# EAGLE schematic FIIDO_D2_MPU6050_display (EAGLE 8.3.1)
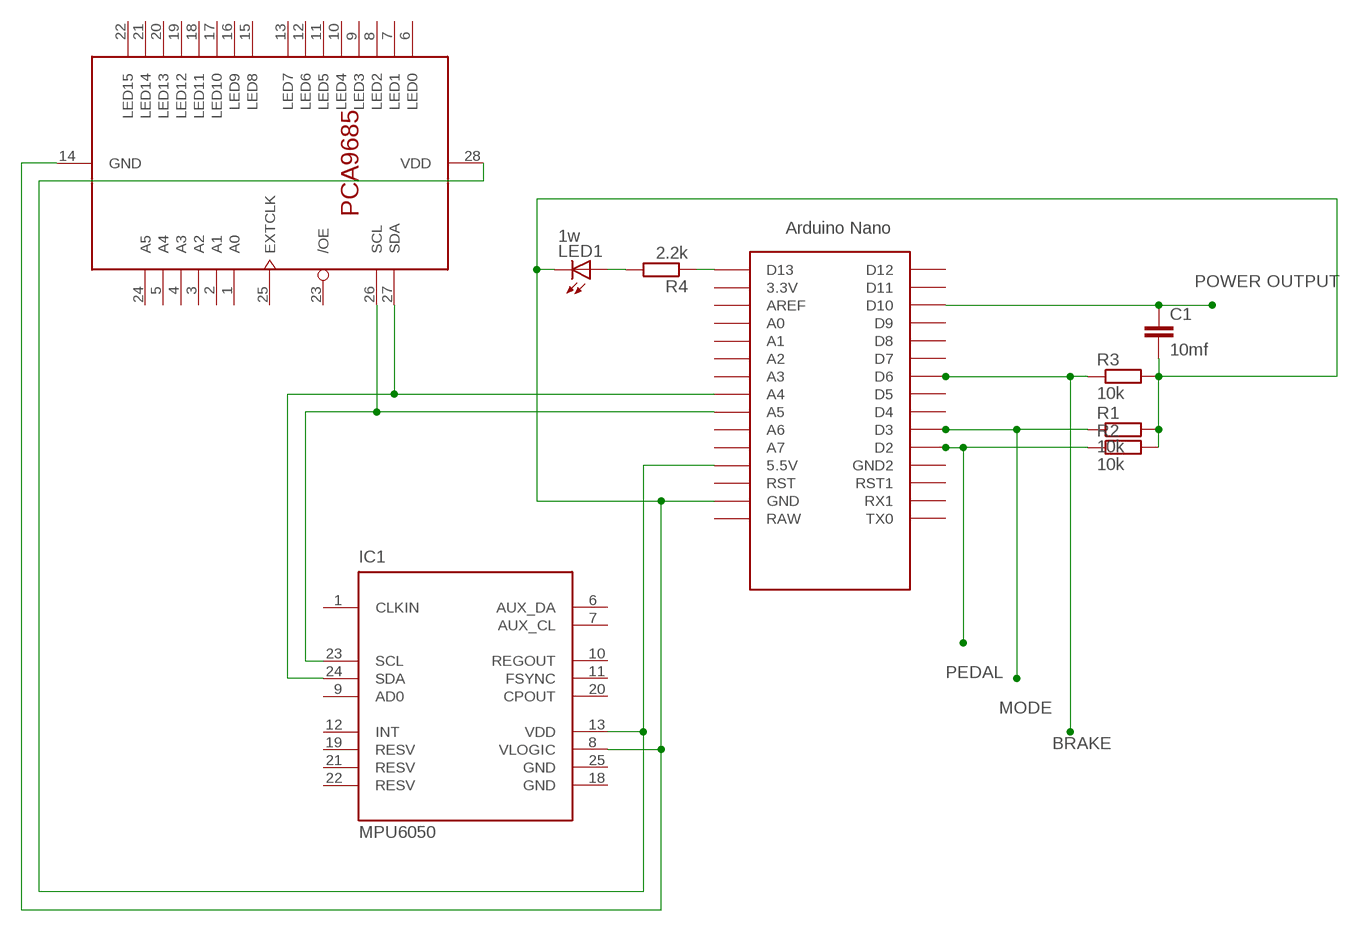
[diagram p0: schematic, sheet 1]

## Parts
C1  10mf  C-EU025-024X044  [C025-024X044]
IC1  MPU6050  [QFN50P400X400X95-25T265X275N]
LED1  1w  LED3MM  [LED3MM]
R1  10k  R-EU_0207/5V  [0207/5V]
R2  10k  R-EU_0207/5V  [0207/5V]
R3  10k  R-EU_0207/5V  [0207/5V]
R4  2.2k  R-EU_0207/5V  [0207/5V]
U$1  NANO  [NANO]
U$2  PCA9685PW  [TSSOP28]

## Nets
N$1: R4.1 U$1.D13
N$2: R3.1 U$1.D6
N$3: R1.1 U$1.D3
N$4: R2.1 U$1.D2
N$5: C1.2 IC1.8(VLOGIC) LED1.K(C) R1.2 R2.2 R3.2 U$1.GND U$2.14(GND)
N$6: IC1.13(VDD) U$1.5V(5.5V) U$2.28(VDD)
N$7: LED1.A R4.2
N$8: C1.1 U$1.D10
N$9: IC1.24(SDA) U$1.A4 U$2.27(SDA)
N$10: IC1.23(SCL) U$1.A5 U$2.26(SCL)
Unconnected: IC1.1(CLKIN) IC1.2(NC) IC1.3(NC) IC1.4(NC) IC1.5(NC) IC1.6(AUX_DA) IC1.7(AUX_CL) IC1.9(AD0) IC1.10(REGOUT) IC1.11(FSYNC) IC1.12(INT) IC1.14(NC) IC1.15(NC) IC1.16(NC) IC1.17(NC) IC1.19(RESV) IC1.20(CPOUT) IC1.21(RESV) IC1.22(RESV) U$1.3.3V U$1.A0 U$1.A1 U$1.A2 U$1.A3 U$1.A6 U$1.A7 U$1.AREF U$1.D4 U$1.D5 U$1.D7 U$1.D8 U$1.D9 U$1.D11 U$1.D12 U$1.GND1(GND2) U$1.ICSP1 U$1.ICSP2 U$1.ICSP3 U$1.ICSP4 U$1.ICSP5 U$1.ICSP6 U$1.RAW U$1.RST U$1.RST1 U$1.RX1 U$1.TX0 U$2.1(A0) U$2.2(A1) U$2.3(A2) U$2.4(A3) U$2.5(A4) U$2.6(LED0) U$2.7(LED1) U$2.8(LED2) U$2.9(LED3) U$2.10(LED4) U$2.11(LED5) U$2.12(LED6) U$2.13(LED7) U$2.15(LED8) U$2.16(LED9) U$2.17(LED10) U$2.18(LED11) U$2.19(LED12) U$2.20(LED13) U$2.21(LED14) U$2.22(LED15) U$2.23(/OE) U$2.24(A5) U$2.25(EXTCLK)

## Notes on the sheet
- POWER OUTPUT
- PEDAL
- MODE
- BRAKE

## Power pins joined to a net without a drawn wire
GND: IC1.18(GND) IC1.25(GND)

## Library data of the parts
C1 = resistor:C-EU: CAPACITOR, European symbol
IC1 = invensense:MPU6050: The triple-axis MEMS gyroscope
LED1 = led:LED: LED OSRAM: - CHIPLED LG R971, LG N971, LY N971, LG Q971, LY Q971, LO R971, LY R971 LH N974, LH R974 LS Q976, LO Q976, LY Q976 LO Q996 - Hyper CHIPLED LW Q18S LB Q993, LB Q99A, LB R99A - SideLED LS A670, LO A670, LY A670, LG A670, LP A670 LB A673, LV A673, LT A673, LW A673 LH A674 LY A675 LS A676, LA A676, LO A676, LY A676, LW A676 LS A679, LY A679, LG A679 - Hyper Micro SIDELED® LS Y876, LA Y876, LO Y876, LY Y876 LT Y87S - SmartLED LW L88C, LW L88S LB L89C, LB L89S, LG L890 LS L89K, LO L89K, LY L89K LS L896, LA L896, LO L896, LY L896 - TOPLED LS T670, LO T670, LY T670, LG T670, LP T670 LSG T670, LSP T670, LSY T670, LOP T670, LYG T670 LG T671, LOG T671, LSG T671 LB T673, LV T673, LT T673, LW T673 LH T674 LS T676, LA T676, LO T676, LY T676, LB T676, LH T676, LSB T676, LW T676 LB T67C, LV T67C, LT T67C, LS T67K, LO T67K, LY T67K, LW E67C LS E67B, LA E67B, LO E67B, LY E67B, LB E67C, LV E67C, LT E67C LW T67C LS T679, LY T679, LG T679 LS T770, LO T770, LY T770, LG T770, LP T770 LB T773, LV T773, LT T773, LW T773 LH T774 LS E675, LA E675, LY E675, LS T675 LS T776, LA T776, LO T776, LY T776, LB T776 LHGB T686 LT T68C, LB T68C - Hyper Mini TOPLED® LB M676 - Mini TOPLED Santana® LG M470 LS M47K, LO M47K, LY M47K Source: http://www.osram.convergy.de LUXEON: - LUMILED® LXK2-PW12-R00, LXK2-PW12-S00, LXK2-PW14-U00, LXK2-PW14-V00 LXK2-PM12-R00, LXK2-PM12-S00, LXK2-PM14-U00 LXK2-PE12-Q00, LXK2-PE12-R00, LXK2-PE12-S00, LXK2-PE14-T00, LXK2-PE14-U00 LXK2-PB12-K00, LXK2-PB12-L00, LXK2-PB12-M00, LXK2-PB14-N00, LXK2-PB14-P00, LXK2-PB14-Q00 LXK2-PR12-L00, LXK2-PR12-M00, LXK2-PR14-Q00, LXK2-PR14-R00 LXK2-PD12-Q00, LXK2-PD12-R00, LXK2-PD12-S00 LXK2-PH12-R00, LXK2-PH12-S00 LXK2-PL12-P00, LXK2-PL12-Q00, LXK2-PL12-R00 Source: www.luxeon.com KINGBRIGHT: KA-3528ASYC Source: www.kingbright.com
R1-R4 = resistor:R-EU_: RESISTOR, European symbol
U$1 = Arduino-clone:NANO: Arduino Nano
U$2 = i2c-led-controller:PCA9685